# Altium project RelaisSchaltung.PrjPcb
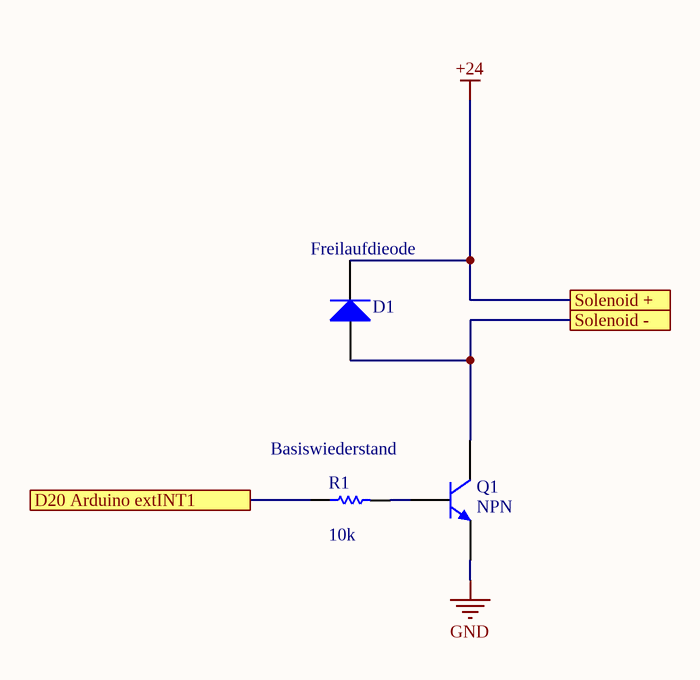
[diagram p0: Schematic.SchDoc]
1 sheet, 3 parts. Net scope: flat (ports and power ports of the same name join across sheets).

## Sheet Schematic.SchDoc
size A4

### Parts
D1  Freilaufdieode  [SMC]
Q1  NPN  [TO-226-AA]
R1  Basiswiederstand  value 10k  [AXIAL-0.3]

### Ports
D20 Arduino extINT1, Solenoid +, Solenoid -

### Nets
+24: D1.2(K) ; port Solenoid +
GND: Q1.3(E)
NetD1_1: D1.1(A) Q1.1(C) ; port Solenoid -
NetQ1_2: Q1.2(B) R1.2
NetR1_1: R1.1 ; port D20 Arduino extINT1

### Library data of the parts
D1 = Diode: Default Diode; Published: 8-Jun-2000; LatestRevisionDate: 17-Jul-2002; LatestRevisionNote: Re-released for DXP Platform.; PackageVersion: Sep-1996; PackageReference: SMC; Publisher: Altium Limited; PackageDescription: DO-214-AB/SMC; 2 C-Bend Leads; Body 7.9 x 5.9 mm, inc. leads (LxW); Code_JEDEC: DO-214-AB
Q1 = NPN: NPN Bipolar Transistor; Published: 8-Jun-2000; LatestRevisionDate: 17-Jul-2002; LatestRevisionNote: Re-released for DXP Platform.; PackageReference: TO-226-AA; Publisher: Altium Limited; PackageDescription: TO, Flat Index; 3 In-Line, Axial Leads; Body Dia. 4.8mm; Leads 0.55 x 0.51 mm (max); Code_JEDEC: TO-226-AA
R1 = Res1: Resistor; Published: 8-Jun-2000; LatestRevisionDate: 17-Jul-2002; LatestRevisionNote: Re-released for DXP Platform.; PackageReference: AXIAL-0.3; Publisher: Altium Limited; PackageDescription: Axial Device, Thru-Hole; 2 Leads; 0.3 in Pin Spacing